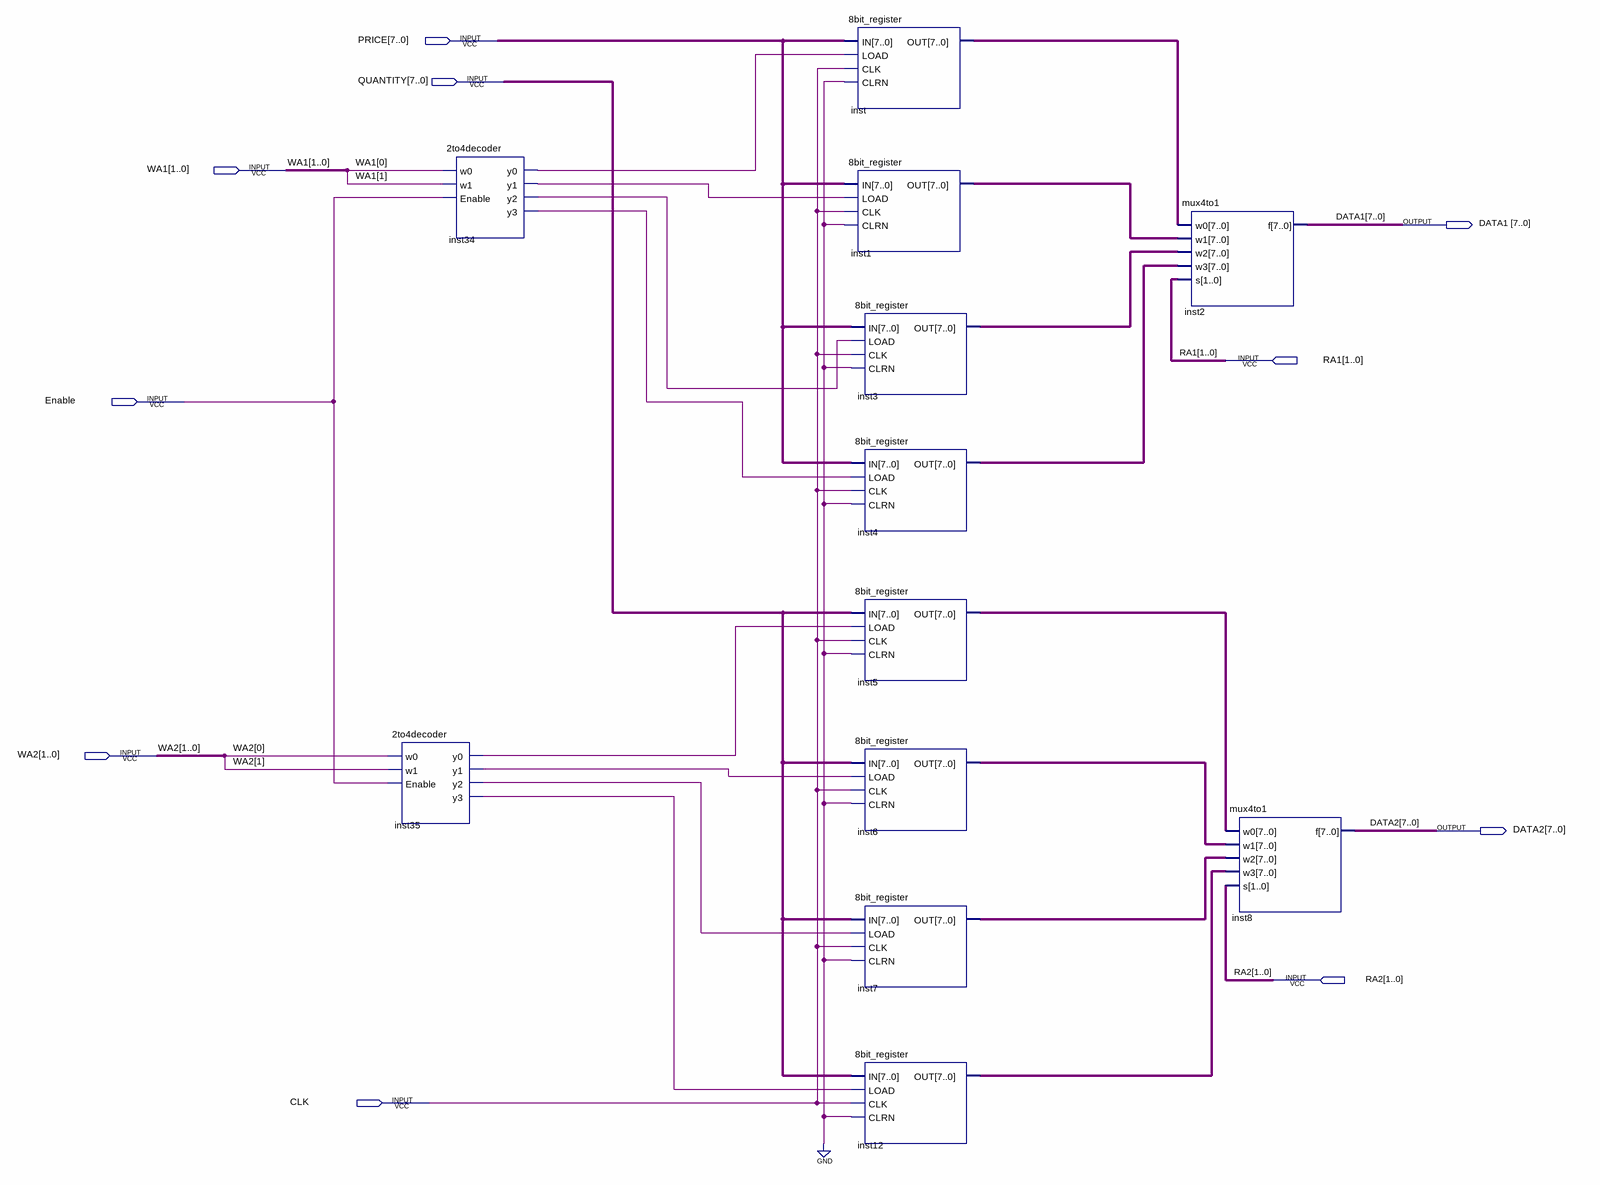
[diagram p0: schematic sheet]
// Quartus schematic register_file.bdf as structural Verilog: 12 symbols, 10 pins
module register_file (
  input  [7:0] PRICE,
  input  [7:0] QUANTITY,
  input  [1:0] WA1,
  input  [1:0] RA1,
  input  Enable,
  input  [1:0] WA2,
  input  [1:0] RA2,
  input  CLK,
  output [7:0] DATA1,
  output [7:0] DATA2
);

  wire inst34_y0, inst34_y1, inst34_y2, inst34_y3, inst35_y0, inst35_y1, inst35_y2, inst35_y3;
  wire [7:0] inst1_out, inst3_out, inst4_out, inst5_out, inst6_out, inst7_out, inst12_out, inst_out;

  \2to4decoder  inst35 (
    .w0(WA2[0]), .w1(WA2[1]), .Enable(Enable), .y0(inst35_y0), .y1(inst35_y1), .y2(inst35_y2), .y3(inst35_y3));
  \2to4decoder  inst34 (
    .w0(WA1[0]), .w1(WA1[1]), .Enable(Enable), .y0(inst34_y0), .y1(inst34_y1), .y2(inst34_y2), .y3(inst34_y3));
  \8bit_register  inst (.IN(PRICE), .LOAD(inst34_y0), .CLK(CLK), .CLRN(1'b0), .OUT(inst_out));
  \8bit_register  inst1 (.IN(PRICE), .LOAD(inst34_y1), .CLK(CLK), .CLRN(1'b0), .OUT(inst1_out));
  \8bit_register  inst3 (.IN(PRICE), .LOAD(inst34_y2), .CLK(CLK), .CLRN(1'b0), .OUT(inst3_out));
  \8bit_register  inst4 (.IN(PRICE), .LOAD(inst34_y3), .CLK(CLK), .CLRN(1'b0), .OUT(inst4_out));
  \8bit_register  inst5 (.IN(QUANTITY), .LOAD(inst35_y0), .CLK(CLK), .CLRN(1'b0), .OUT(inst5_out));
  \8bit_register  inst6 (.IN(QUANTITY), .LOAD(inst35_y1), .CLK(CLK), .CLRN(1'b0), .OUT(inst6_out));
  \8bit_register  inst7 (.IN(QUANTITY), .LOAD(inst35_y2), .CLK(CLK), .CLRN(1'b0), .OUT(inst7_out));
  \8bit_register  inst12 (.IN(QUANTITY), .LOAD(inst35_y3), .CLK(CLK), .CLRN(1'b0), .OUT(inst12_out));
  mux4to1 inst2 (.w0(inst_out), .w1(inst1_out), .w2(inst3_out), .w3(inst4_out), .s(RA1), .f(DATA1));
  mux4to1 inst8 (.w0(inst5_out), .w1(inst6_out), .w2(inst7_out), .w3(inst12_out), .s(RA2), .f(DATA2));
endmodule
